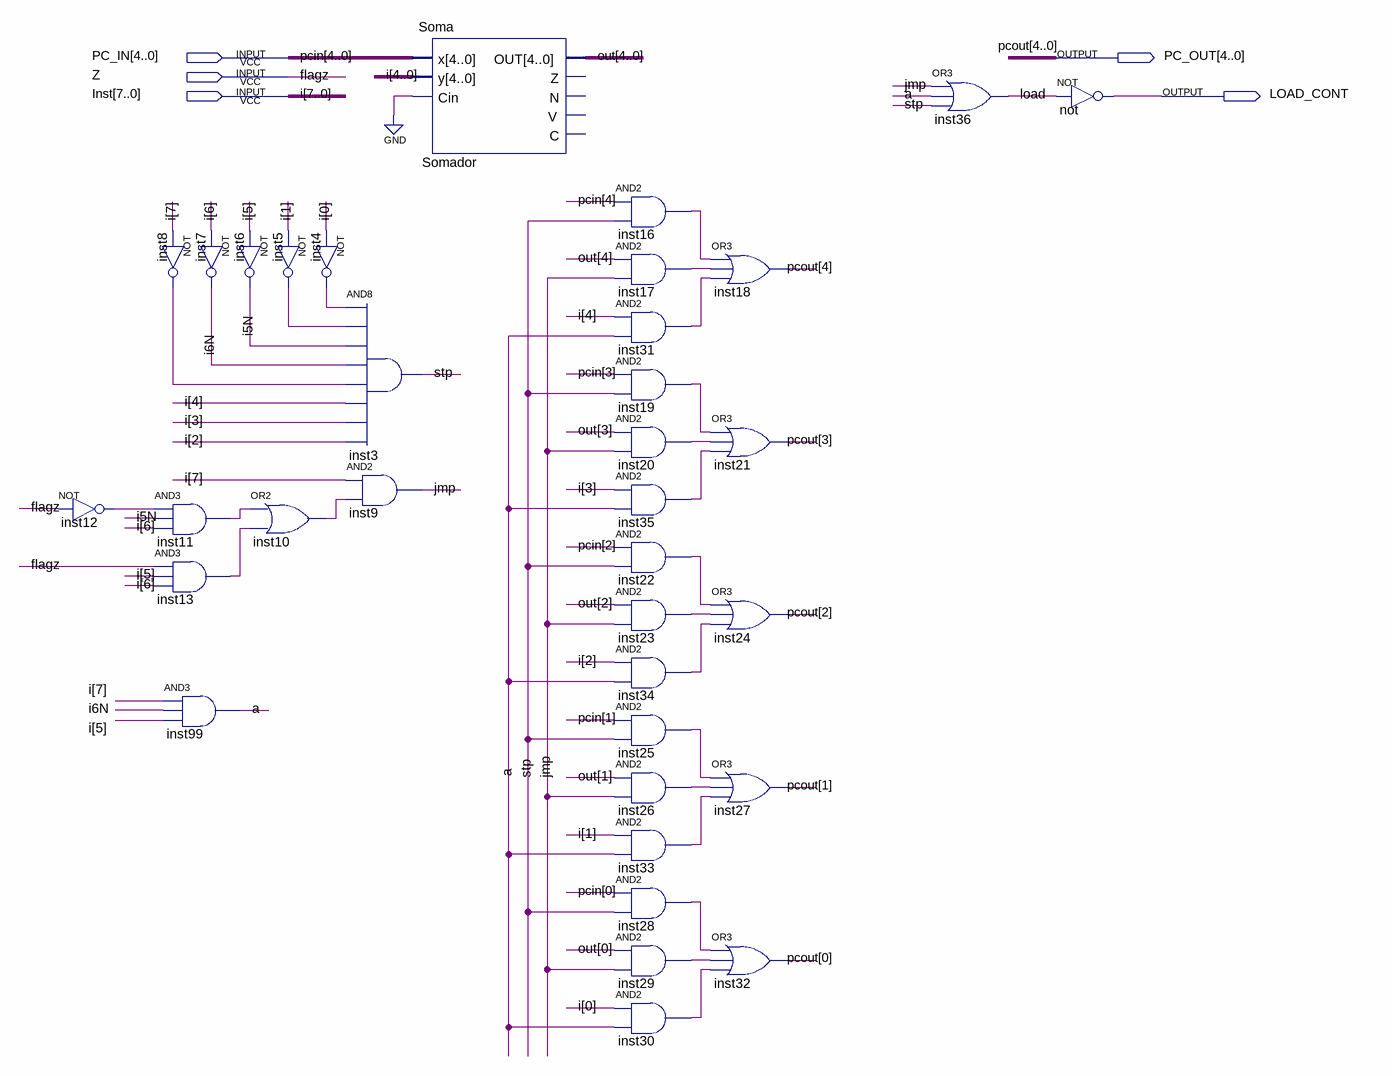
[diagram p0: schematic sheet]
// Quartus schematic ParadaDesvio.bdf as structural Verilog: 35 symbols, 5 pins
module ParadaDesvio (
  input  [4:0] PC_IN,
  input  Z,
  input  [7:0] Inst,
  output [4:0] PC_OUT,
  output LOAD_CONT
);

  wire a, i5N, i6N, inst4_out, inst5_out, inst8_out, inst10_out, inst11_out, inst12_out, inst13_out,
       inst16_out, inst17_out, inst19_out, inst20_out, inst22_out, inst23_out, inst25_out, inst26_out,
       inst28_out, inst29_out, inst30_out, inst31_out, inst33_out, inst34_out, inst35_out, jmp, load, stp;
  wire [4:0] out;

  not inst12 (inst12_out, Z);
  not inst7 (i6N, Inst[6]);
  not inst8 (inst8_out, Inst[7]);
  and inst11 (inst11_out, inst12_out, i5N, Inst[6]);
  and inst13 (inst13_out, Z, Inst[5], Inst[6]);
  and inst99 (a, Inst[7], i6N, Inst[5]);
  not inst5 (inst5_out, Inst[1]);
  not inst6 (i5N, Inst[5]);
  or inst10 (inst10_out, inst11_out, inst13_out);
  not inst4 (inst4_out, Inst[0]);
  and inst3 (stp, inst4_out, inst5_out, i5N, i6N, inst8_out, Inst[4], Inst[3], Inst[2]);
  and inst9 (jmp, Inst[7], inst10_out);
  Soma Somador (.x(PC_IN), .y(Inst[4:0]), .Cin(1'b0), .OUT(out));  // open: Z, N, V, C
  and inst16 (inst16_out, PC_IN[4], stp);
  and inst17 (inst17_out, out[4], jmp);
  and inst31 (inst31_out, Inst[4], a);
  and inst19 (inst19_out, PC_IN[3], stp);
  and inst20 (inst20_out, out[3], jmp);
  and inst35 (inst35_out, Inst[3], a);
  and inst22 (inst22_out, PC_IN[2], stp);
  and inst23 (inst23_out, out[2], jmp);
  and inst34 (inst34_out, Inst[2], a);
  and inst25 (inst25_out, PC_IN[1], stp);
  and inst26 (inst26_out, out[1], jmp);
  and inst33 (inst33_out, Inst[1], a);
  and inst28 (inst28_out, PC_IN[0], stp);
  and inst29 (inst29_out, out[0], jmp);
  and inst30 (inst30_out, Inst[0], a);
  or inst18 (PC_OUT[4], inst16_out, inst17_out, inst31_out);
  or inst21 (PC_OUT[3], inst19_out, inst20_out, inst35_out);
  or inst24 (PC_OUT[2], inst22_out, inst23_out, inst34_out);
  or inst27 (PC_OUT[1], inst25_out, inst26_out, inst33_out);
  or inst32 (PC_OUT[0], inst28_out, inst29_out, inst30_out);
  or inst36 (load, jmp, a, stp);
  not \not  (LOAD_CONT, load);

  // Other names for the same wires on the sheet: flagz = Z; i[7:0] = Inst; pcin[4:0] = PC_IN; pcout[4:0] = PC_OUT
endmodule
